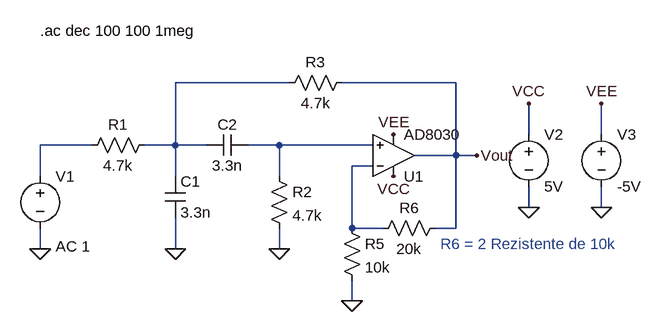
[diagram p0: schematic Etaj2 AC Castig in banda de trecere specs.asc]
Etaj2 AC Castig in banda de trecere specs.asc, the LTspice schematic file:
Version 4.1
SHEET 1 1192 680
WIRE 544 -80 368 -80
WIRE 800 -80 624 -80
WIRE 912 0 912 -48
WIRE 1024 0 1024 -48
WIRE 240 16 160 16
WIRE 368 16 368 -80
WIRE 368 16 320 16
WIRE 416 16 368 16
WIRE 528 16 480 16
WIRE 672 16 528 16
WIRE 800 32 800 -80
WIRE 800 32 736 32
WIRE 832 32 800 32
WIRE 672 48 640 48
WIRE 160 64 160 16
WIRE 368 64 368 16
WIRE 528 64 528 16
WIRE 912 112 912 80
WIRE 1024 112 1024 80
WIRE 640 144 640 48
WIRE 688 144 640 144
WIRE 800 144 800 32
WIRE 800 144 768 144
WIRE 160 176 160 144
WIRE 368 176 368 128
WIRE 528 176 528 144
WIRE 640 256 640 224
FLAG 160 176 0
FLAG 368 176 0
FLAG 528 176 0
FLAG 640 256 0
FLAG 912 112 0
FLAG 1024 112 0
FLAG 912 -48 VCC
FLAG 704 64 VCC
FLAG 704 0 VEE
FLAG 1024 -48 VEE
FLAG 832 32 Vout
SYMBOL voltage 160 48 R0
WINDOW 123 24 124 Left 2
WINDOW 39 0 0 Left 0
SYMATTR Value2 AC 1
SYMATTR InstName V1
SYMATTR Value ""
SYMBOL res 336 0 R90
WINDOW 0 0 56 VBottom 2
WINDOW 3 32 56 VTop 2
SYMATTR InstName R1
SYMATTR Value 4.7k
SYMBOL cap 352 64 R0
SYMATTR InstName C1
SYMATTR Value 3.3n
SYMBOL cap 480 0 R90
WINDOW 0 0 32 VBottom 2
WINDOW 3 32 32 VTop 2
SYMATTR InstName C2
SYMATTR Value 3.3n
SYMBOL res 512 48 R0
SYMATTR InstName R2
SYMATTR Value 4.7k
SYMBOL OpAmps\\AD8030 704 96 M180
SYMATTR InstName U1
SYMBOL res 784 128 R90
WINDOW 0 0 56 VBottom 2
WINDOW 3 32 56 VTop 2
SYMATTR InstName R6
SYMATTR Value 20k
SYMBOL res 624 128 R0
SYMATTR InstName R5
SYMATTR Value 10k
SYMBOL res 640 -96 R90
WINDOW 0 0 56 VBottom 2
WINDOW 3 32 56 VTop 2
SYMATTR InstName R3
SYMATTR Value 4.7k
SYMBOL voltage 912 -16 R0
WINDOW 123 0 0 Left 0
WINDOW 39 0 0 Left 0
SYMATTR InstName V2
SYMATTR Value 5V
SYMBOL voltage 1024 -16 R0
WINDOW 123 0 0 Left 0
WINDOW 39 0 0 Left 0
SYMATTR InstName V3
SYMATTR Value -5V
TEXT 776 168 Left 2 ;R6 = 2 Rezistente de 10k
TEXT 160 -160 Left 2 !.ac dec 100 100 1meg

The netlist it stands for:
* Etaj2 AC Castig in banda de trecere specs.asc
V1 N002 0 AC 1
R1 N001 N002 4.7k
C1 N001 0 3.3n
C2 N003 N001 3.3n
R2 N003 0 4.7k
X§U1 N003 N004 VCC VEE Vout AD8040  ; AD8030, pins In+ In- V+ V- OUT
R6 Vout N004 20k
R5 N004 0 10k
R3 Vout N001 4.7k
V2 VCC 0 5V
V3 VEE 0 -5V
* R6 = 2 Rezistente de 10k
.ac dec 100 100 1meg
.lib ADI.lib
.backanno
.end

* Results of the author's LTspice run, read from the files saved beside the schematic
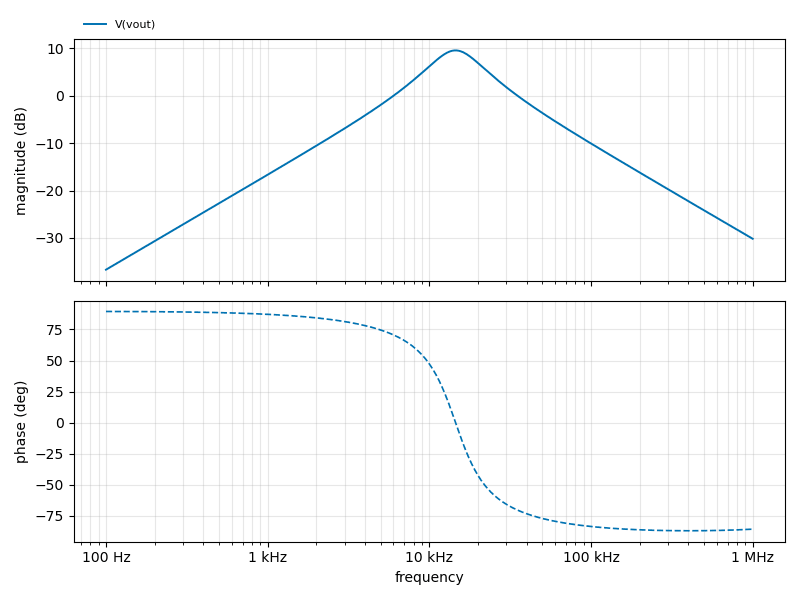
[diagram p1: AC Analysis of Etaj2 AC Castig in banda de trecere specs.asc, plotted from the saved traces]
* AC Analysis, 1 run:
*   V(vout): -36.70 dB at 100 Hz, -30.17 dB at 1 MHz, peak 9.55 dB at 14.45 kHz, 3 dB below the peak at 10.27 kHz and 20.54 kHz